# Altium schematic sheet TempalteNew.SchDoc
size A4; Engineer: Görkem BULUT; SheetNumber: 3; SheetTotal: 3
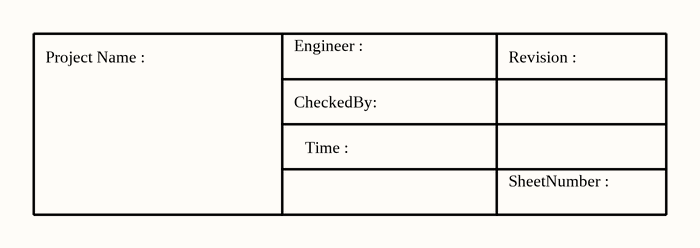
[diagram p0: TempalteNew.SchDoc]

## Notes on the sheet
- Project Name :
- Engineer :
- Revision :
- CheckedBy:
- Time :
- SheetNumber :